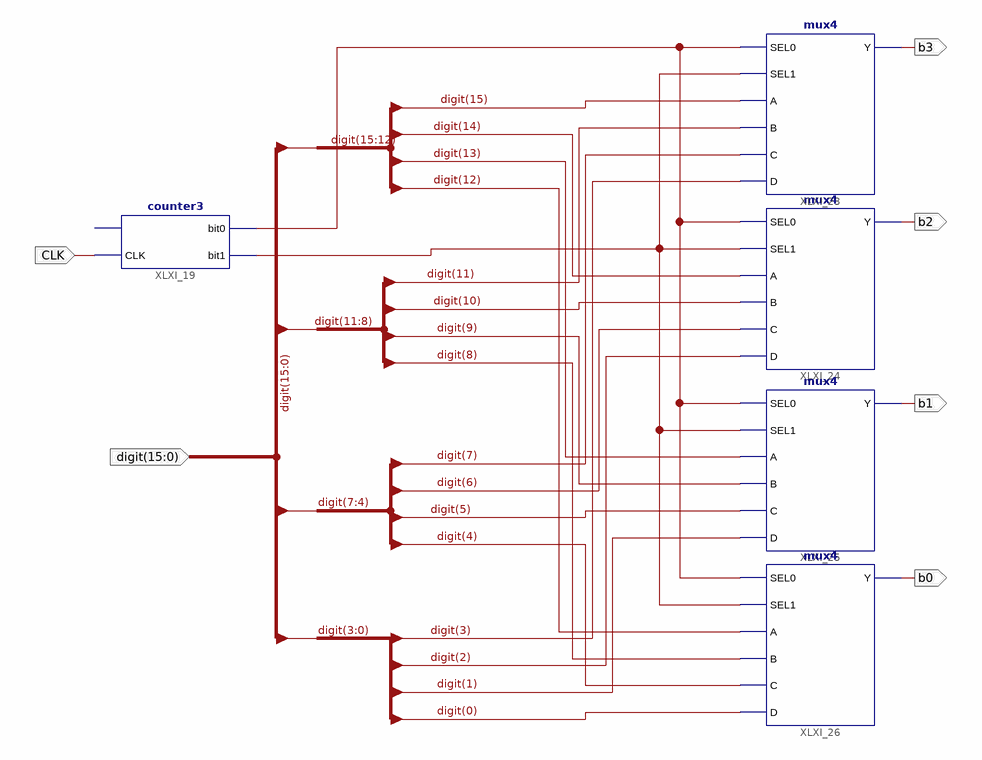
[diagram p0: schematic sheet 1]
// Xilinx ISE schematic dataSEL.sch (spartan6) as structural Verilog: 5 symbols, 6 ports
module dataSEL (
  input  CLK,
  input  [15:0] digit,
  output b3,
  output b2,
  output b1,
  output b0
);

  wire XLXN_71, XLXN_74;

  counter3 XLXI_19 (.CLK(CLK), .bit0(XLXN_71), .bit1(XLXN_74));  // open: CLR
  mux4 XLXI_24 (.SEL0(XLXN_71), .SEL1(XLXN_74), .A(digit[14]), .B(digit[10]), .C(digit[6]), .D(digit[2]), .Y(b2));
  mux4 XLXI_25 (.SEL0(XLXN_71), .SEL1(XLXN_74), .A(digit[13]), .B(digit[9]), .C(digit[5]), .D(digit[1]), .Y(b1));
  mux4 XLXI_26 (.SEL0(XLXN_71), .SEL1(XLXN_74), .A(digit[12]), .B(digit[8]), .C(digit[4]), .D(digit[0]), .Y(b0));
  mux4 XLXI_23 (.SEL0(XLXN_71), .SEL1(XLXN_74), .A(digit[15]), .B(digit[11]), .C(digit[7]), .D(digit[3]), .Y(b3));
endmodule
